# Altium project transmit.PrjPcb
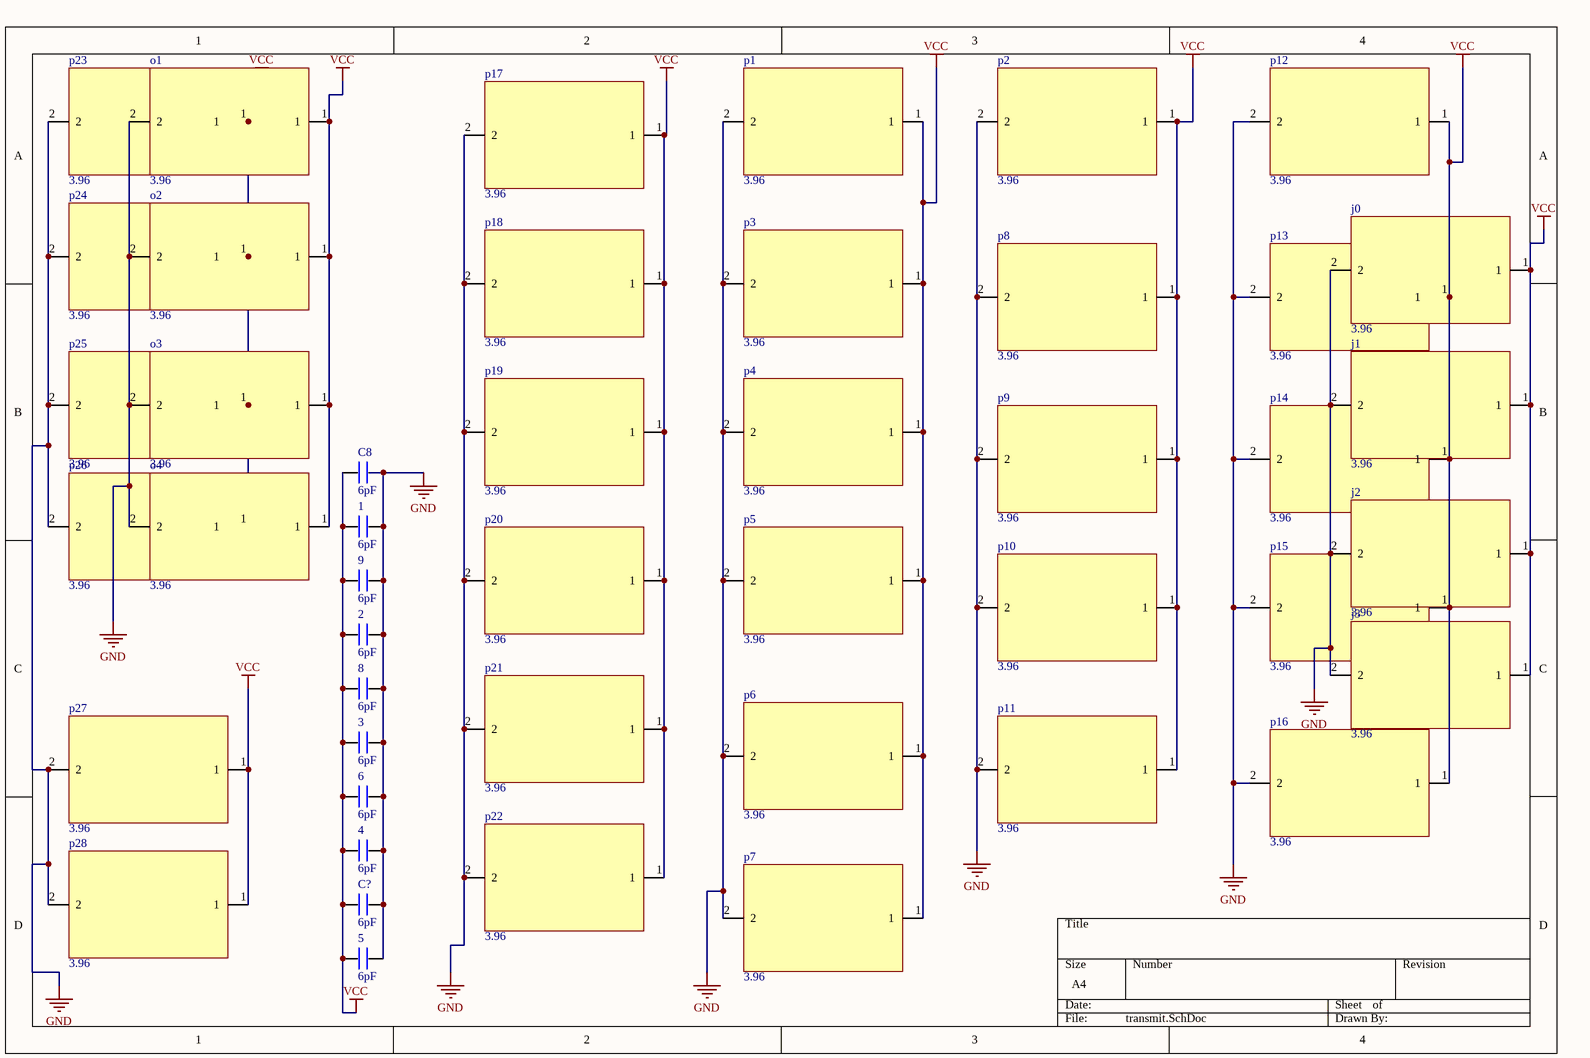
[diagram p0: transmit.SchDoc]
1 sheet, 46 parts. Net scope: global (net labels, ports and power ports of the same name join across sheets).
Board file: transmit.PcbDoc

## Sheet transmit.SchDoc
size A4

### Parts
1  6pF  [CAP 7.5*18*35.5 - GD]
2  6pF  [CAP 7.5*18*35.5 - GD]
3  6pF  [CAP 7.5*18*35.5 - GD]
4  6pF  [CAP 7.5*18*35.5 - GD]
5  6pF  [CAP 7.5*18*35.5 - GD]
6  6pF  [CAP 7.5*18*35.5 - GD]
8  6pF  [CAP 7.5*18*35.5 - GD]
9  6pF  [CAP 7.5*18*35.5 - GD]
C8  6pF  [CAP 7.5*18*35.5 - GD]
C?  6pF  [CAP 7.5*18*35.5 - GD]
j0  3.96  [3.96]
j1  3.96  [3.96]
j2  3.96  [3.96]
j3  3.96  [3.96]
o1  3.96  [3.96]
o2  3.96  [3.96]
o3  3.96  [3.96]
o4  3.96  [3.96]
p1  3.96  [3.96]
p2  3.96  [3.96]
p3  3.96  [3.96]
p4  3.96  [3.96]
p5  3.96  [3.96]
p6  3.96  [3.96]
p7  3.96  [3.96]
p8  3.96  [3.96]
p9  3.96  [3.96]
p10  3.96  [3.96]
p11  3.96  [3.96]
p12  3.96  [3.96]
p13  3.96  [3.96]
p14  3.96  [3.96]
p15  3.96  [3.96]
p16  3.96  [3.96]
p17  3.96  [3.96]
p18  3.96  [3.96]
p19  3.96  [3.96]
p20  3.96  [3.96]
p21  3.96  [3.96]
p22  3.96  [3.96]
p23  3.96  [3.96]
p24  3.96  [3.96]
p25  3.96  [3.96]
p26  3.96  [3.96]
p27  3.96  [3.96]
p28  3.96  [3.96]

### Nets
GND: 1.2 2.2 3.2 4.2 5.2 6.2 8.2 9.2 C8.2 C?.2 j0.2 j1.2 j2.2 j3.2 o1.2 o2.2 o3.2 o4.2 p1.2 p2.2 p3.2 p4.2 p5.2 p6.2 p7.2 p8.2 p9.2 p10.2 p11.2 p12.2 p13.2 p14.2 p15.2 p16.2 p17.2 p18.2 p19.2 p20.2 p21.2 p22.2 p23.2 p24.2 p25.2 p26.2 p27.2 p28.2
VCC: 1.1 2.1 3.1 4.1 5.1 6.1 8.1 9.1 C8.1 C?.1 j0.1 j1.1 j2.1 j3.1 o1.1 o2.1 o3.1 o4.1 p1.1 p2.1 p3.1 p4.1 p5.1 p6.1 p7.1 p8.1 p9.1 p10.1 p11.1 p12.1 p13.1 p14.1 p15.1 p16.1 p17.1 p18.1 p19.1 p20.1 p21.1 p22.1 p23.1 p24.1 p25.1 p26.1 p27.1 p28.1

### Library data of the parts
1-6 8 9 C8 C? = C: Capacitor